# Altium schematic sheet conexion_sensor_hall.SchDoc
size A4
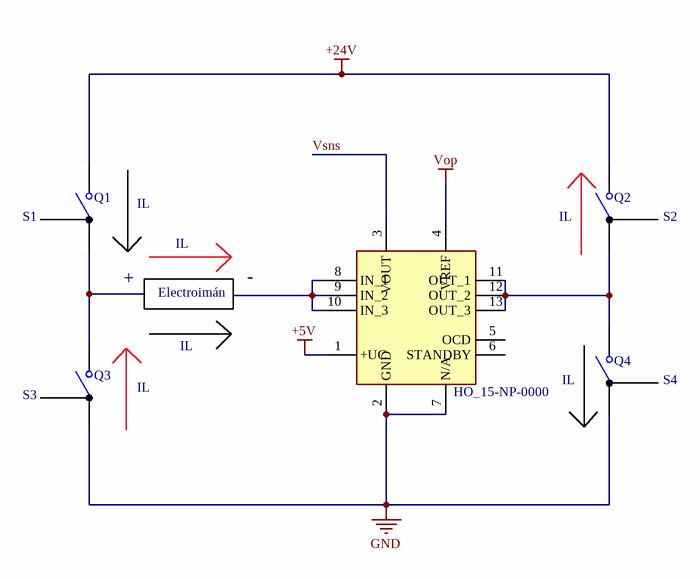
[diagram p0: conexion_sensor_hall.SchDoc]

## Parts
Q1  SW-SPST  [SPST-2]  (value not drawn)
Q2  SW-SPST  [SPST-2]  (value not drawn)
Q3  SW-SPST  [SPST-2]  (value not drawn)
Q4  SW-SPST  [SPST-2]  (value not drawn)
U103  HO_15-NP-0000  [HO15NP0000]

## Nets
+5V: U103.1(+UC)
+24V: Q1.2(NO) Q2.2(NO)
GND: Q3.1(COMMON) Q4.1(COMMON) U103.2(GND) U103.7(N/A)
Vop: U103.4(VREF)
Vsns: U103.3(VOUT)
NetQ1_1: Q1.1(COMMON) Q3.2(NO)
NetQ2_1: Q2.1(COMMON) Q4.2(NO) U103.11(OUT_1) U103.12(OUT_2) U103.13(OUT_3)
NetU103_8: U103.8(IN_1) U103.9(IN_2) U103.10(IN_3)

Not connected (* = marked no-connect by the designer): U103 5(OCD) 6(STANDBY)

## Notes on the sheet
- (near Q1) IL
- (near Q1) S1
- +
- IL
- -
- (near Q2) IL
- (near Q2) S2
- Electroimán
- (near Q3) S3
- (near Q3) IL
- (near Q4) IL
- (near Q4) S4

## Library data of the parts
Q1-Q4 = SW-SPST: Single-Pole, Single-Throw Switch; Published: 24-Mar-1999; LatestRevisionDate: 17-Jul-2002; LatestRevisionNote: Re-released for DXP Platform.; PackageReference: SPST-2; Publisher: Altium Limited; PackageDescription: Switch; 2 Leads
U103 = HO_15-NP-0000: SENSOR CURRENT HALL 15A AC/DC; Mfr PN: HO 15-NP-0000; Manufacturer: LEM USA Inc.; Datasheet Link: http://www.farnell.com/datasheets/2150001.pdf; Supplier 1 PN: 398-1142-ND; Supplier 1: Digi-Key